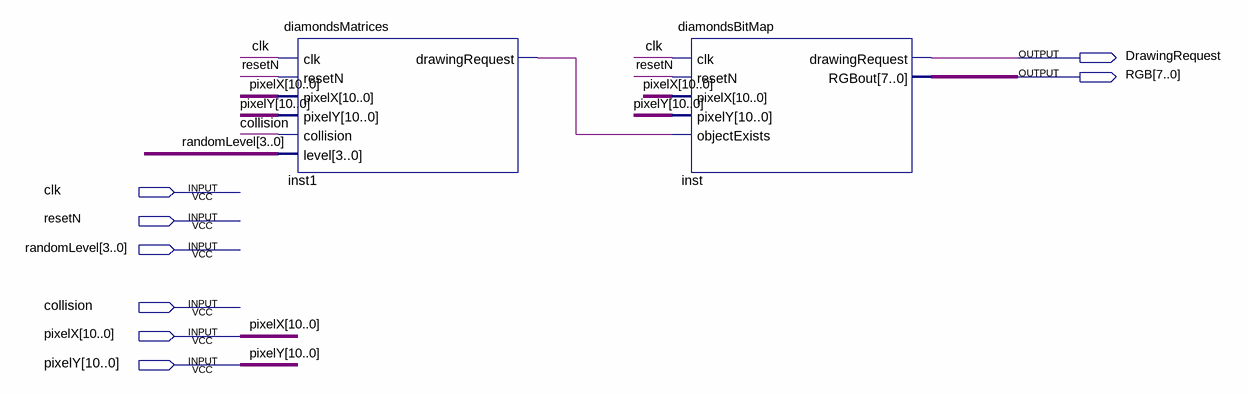
[diagram p0: schematic sheet]
// Quartus schematic diamondsTop.bdf as structural Verilog: 2 symbols, 8 pins
module diamondsTop (
  input  clk,
  input  resetN,
  input  [3:0] randomLevel,
  input  collision,
  input  [10:0] pixelX,
  input  [10:0] pixelY,
  output DrawingRequest,
  output [7:0] RGB
);

  wire inst1_drawingrequest;

  diamondsMatrices inst1 (
    .clk(clk), .resetN(resetN), .pixelX(pixelX), .pixelY(pixelY), .collision(collision), .level(randomLevel),
    .drawingRequest(inst1_drawingrequest));
  diamondsBitMap inst (
    .clk(clk), .resetN(resetN), .pixelX(pixelX), .pixelY(pixelY), .objectExists(inst1_drawingrequest),
    .drawingRequest(DrawingRequest), .RGBout(RGB));
endmodule
